# Altium schematic sheet switches_LEDs.SchDoc
size A4; SheetNumber: 4; SheetTotal: 6
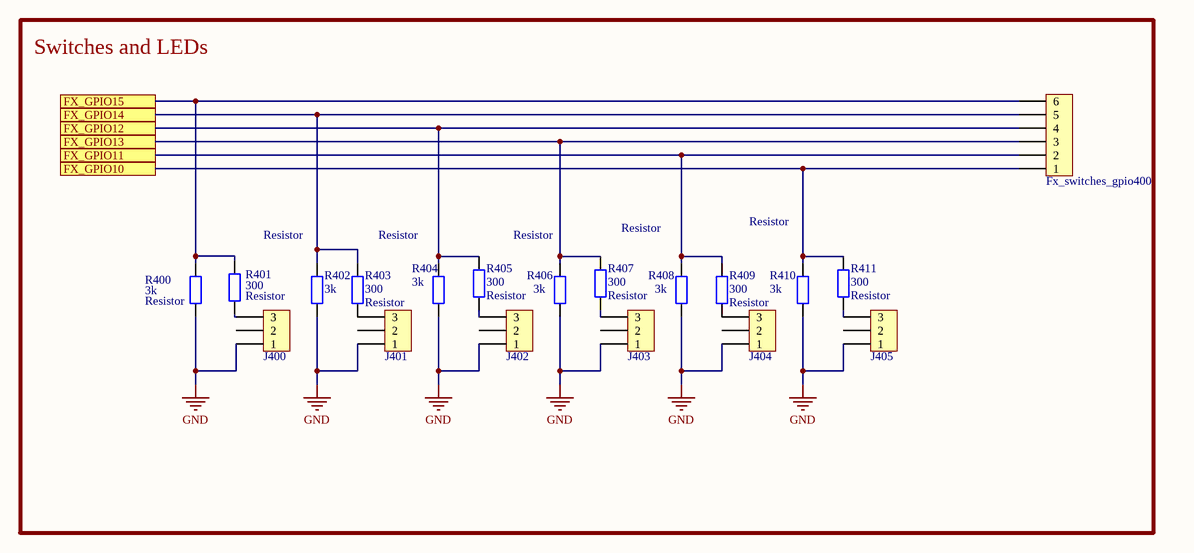
[diagram p0: switches_LEDs.SchDoc]

## Parts
Fx_switches_gpio400  Header 1x6  [Header 1x6]  (value not drawn)
J400  Header 1x3  [Header 1x3]  (value not drawn)
J401  Header 1x3  [Header 1x3]  (value not drawn)
J402  Header 1x3  [Header 1x3]  (value not drawn)
J403  Header 1x3  [Header 1x3]  (value not drawn)
J404  Header 1x3  [Header 1x3]  (value not drawn)
J405  Header 1x3  [Header 1x3]  (value not drawn)
R400  Resistor  value 3k  [RES THT 9mm]
R401  Resistor  value 300  [RES THT 9mm]
R402  Resistor  value 3k  [RES THT 9mm]
R403  Resistor  value 300  [RES THT 9mm]
R404  Resistor  value 3k  [RES THT 9mm]
R405  Resistor  value 300  [RES THT 9mm]
R406  Resistor  value 3k  [RES THT 9mm]
R407  Resistor  value 300  [RES THT 9mm]
R408  Resistor  value 3k  [RES THT 9mm]
R409  Resistor  value 300  [RES THT 9mm]
R410  Resistor  value 3k  [RES THT 9mm]
R411  Resistor  value 300  [RES THT 9mm]

## Blocks framed on the sheet
Switches and LEDs: Fx_switches_gpio400 J400-J405 R400-R411

## Ports
FX_GPIO10, FX_GPIO11, FX_GPIO12, FX_GPIO13, FX_GPIO14, FX_GPIO15

## Nets
GND: J400.1 J401.1 J402.1 J403.1 J404.1 J405.1 R400.1 R402.1 R404.1 R406.1 R408.1 R410.1
FX_GPIO10: Fx_switches_gpio400.1 R410.2 R411.2 ; port FX_GPIO10
FX_GPIO11: Fx_switches_gpio400.2 R408.2 R409.2 ; port FX_GPIO11
FX_GPIO12: Fx_switches_gpio400.4 R404.2 R405.2 ; port FX_GPIO12
FX_GPIO13: Fx_switches_gpio400.3 R406.2 R407.2 ; port FX_GPIO13
FX_GPIO14: Fx_switches_gpio400.5 R402.2 R403.2 ; port FX_GPIO14
FX_GPIO15: Fx_switches_gpio400.6 R400.2 R401.2 ; port FX_GPIO15
NetJ400_3: J400.3 R401.1
NetJ401_3: J401.3 R403.1
NetJ402_3: J402.3 R405.1
NetJ403_3: J403.3 R407.1
NetJ404_3: J404.3 R409.1
NetJ405_3: J405.3 R411.1

Not connected (* = marked no-connect by the designer): J400 2; J401 2; J402 2; J403 2; J404 2; J405 2